# Altium schematic sheet RT3301AF260Q.SchDoc
size A; SheetNumber: 7; SheetTotal: 7
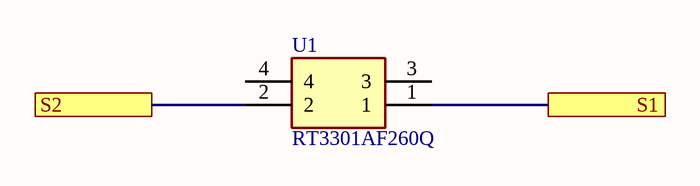
[diagram p0: RT3301AF260Q.SchDoc]

## Parts
U1  RT3301AF260Q  [RT3301AF260Q]

## Ports
S1 (see mainsheet[2C]), S2 (see mainsheet[2D])

## Nets
S1: U1.1 ; port S1
S2: U1.2 ; port S2

Not connected (* = marked no-connect by the designer): U1 3 4

## Library data of the parts
U1 = RT3301AF260Q: Switch; Manufacturer_Name: E-Switch; Datasheet Link: https://configured-product-images.s3.amazonaws.com/2D/specs/RT3301AF260Q.pdf; Height: 5.5mm; Manufacturer_Part_Number: RT3301AF260Q; Mouser Part Number: 612-RT3301AF260Q; Mouser Price/Stock: https://www.mouser.co.uk/ProductDetail/E-Switch/RT3301AF260Q?qs=9vOqFld9vZXQ7mjGs7Hlew%3D%3D